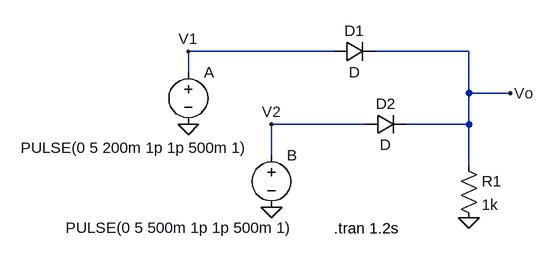
[diagram p0: schematic Punto5.asc]
Punto5.asc, the LTspice schematic file:
Version 4
SHEET 1 880 680
WIRE 240 48 16 48
WIRE 448 48 304 48
WIRE 16 80 16 48
WIRE 448 112 448 48
WIRE 512 112 448 112
WIRE 288 160 144 160
WIRE 448 160 448 112
WIRE 448 160 352 160
WIRE 144 208 144 160
WIRE 448 224 448 160
FLAG 144 288 0
FLAG 16 160 0
FLAG 448 304 0
FLAG 512 112 Vo
FLAG 16 48 V1
FLAG 144 160 V2
SYMBOL voltage 16 64 R0
WINDOW 3 -258 132 Left 2
WINDOW 123 0 0 Left 0
WINDOW 39 0 0 Left 0
SYMATTR Value PULSE(0 5 200m 1p 1p 500m 1)
SYMATTR InstName A
SYMBOL voltage 144 192 R0
WINDOW 3 -317 127 Left 2
WINDOW 123 0 0 Left 0
WINDOW 39 0 0 Left 0
SYMATTR Value PULSE(0 5 500m 1p 1p 500m 1)
SYMATTR InstName B
SYMBOL diode 240 64 R270
WINDOW 0 32 32 VTop 2
WINDOW 3 0 32 VBottom 2
SYMATTR InstName D1
SYMBOL diode 288 176 R270
WINDOW 0 32 32 VTop 2
WINDOW 3 0 32 VBottom 2
SYMATTR InstName D2
SYMBOL res 432 208 R0
SYMATTR InstName R1
SYMATTR Value 1k
TEXT 240 320 Left 2 !.tran 1.2s

The netlist it stands for:
* Punto5.asc
V§A V1 0 PULSE(0 5 200m 1p 1p 500m 1)
V§B V2 0 PULSE(0 5 500m 1p 1p 500m 1)
D1 V1 Vo D
D2 V2 Vo D
R1 Vo 0 1k
.model D D
.lib standard.dio
.tran 1.2s
.backanno
.end

* Results of the author's LTspice run, read from the files saved beside the schematic
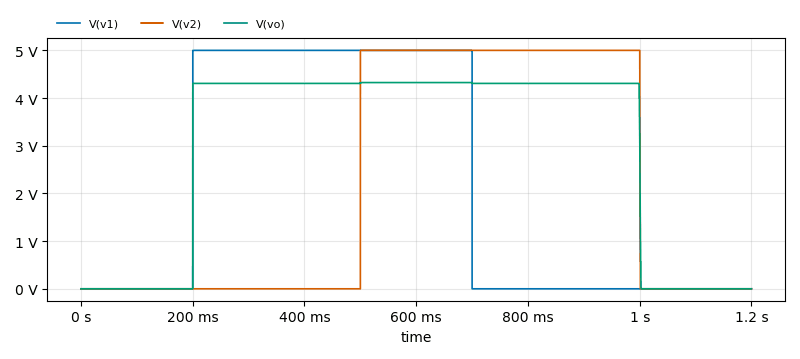
[diagram p1: Transient Analysis of Punto5.asc, plotted from the saved traces]
* Transient Analysis, 1 run:
*   V(v1): min 0 V, max 5 V, average 2.083 V, rms 3.227 V, last 1.11 mV
*   V(v2): min 0 V, max 5 V, average 2.086 V, rms 3.229 V, last 0 V
*   V(vo): min 0 V, max 4.325 V, average 2.876 V, rms 3.521 V, last 0 V